# Altium schematic sheet ESC.SchDoc: MiniFly
size A4; Author: liujun6037; Revision: 0; Version: V1.32; SheetSize: A4
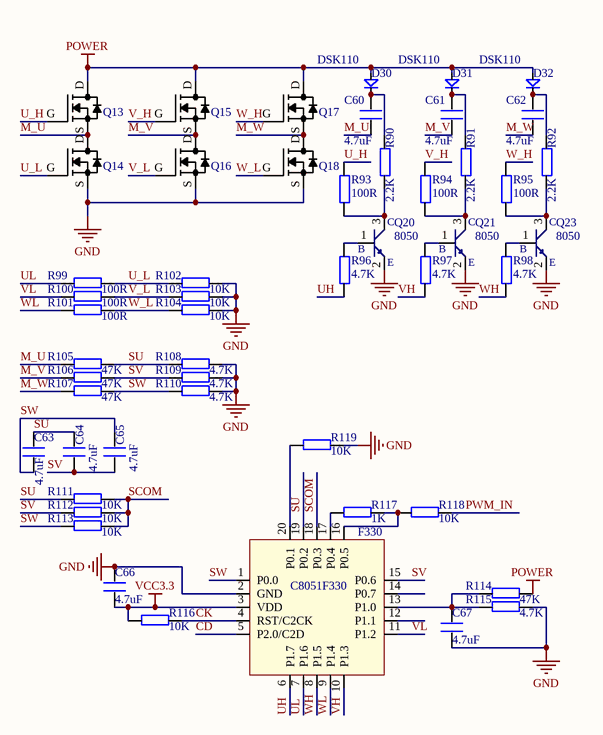
[diagram p0: ESC.SchDoc]

## Parts
C60  4.7uF  [C 0603_L]
C61  4.7uF  [C 0603_L]
C62  4.7uF  [C 0603_L]
C63  4.7uF  [C 0603_L]
C64  4.7uF  [C 0603_L]
C65  4.7uF  [C 0603_L]
C66  4.7uF  [C 0603_L]
C67  4.7uF  [C 0603_L]
D30  DSK110  [SOD-123F]
D31  DSK110  [SOD-123F]
D32  DSK110  [SOD-123F]
F330  C8051F330  [QFN20_4*4_L]
Q13  NTMFS5C628NLT  [SO_8FL_DFN5]  (value not drawn)
Q14  NTMFS5C628NLT  [SO_8FL_DFN5]  (value not drawn)
Q15  NTMFS5C628NLT  [SO_8FL_DFN5]  (value not drawn)
Q16  NTMFS5C628NLT  [SO_8FL_DFN5]  (value not drawn)
Q17  NTMFS5C628NLT  [SO_8FL_DFN5]  (value not drawn)
Q18  NTMFS5C628NLT  [SO_8FL_DFN5]  (value not drawn)
Q20  8050  [SOT23-3L]
Q21  8050  [SOT23-3L]
Q23  8050  [SOT23-3L]
R90  2.2K  [R 0603_L]
R91  2.2K  [R 0603_L]
R92  2.2K  [R 0603_L]
R93  100R  [R 0603_L]
R94  100R  [R 0603_L]
R95  100R  [R 0603_L]
R96  4.7K  [R 0603_L]
R97  4.7K  [R 0603_L]
R98  4.7K  [R 0603_L]
R99  100R  [R 0603_L]
R100  100R  [R 0603_L]
R101  100R  [R 0603_L]
R102  10K  [R 0603_L]
R103  10K  [R 0603_L]
R104  10K  [R 0603_L]
R105  47K  [R 0603_L]
R106  47K  [R 0603_L]
R107  47K  [R 0603_L]
R108  4.7K  [R 0603_L]
R109  4.7K  [R 0603_L]
R110  4.7K  [R 0603_L]
R111  10K  [R 0603_L]
R112  10K  [R 0603_L]
R113  10K  [R 0603_L]
R114  47K  [R 0603_L]
R115  4.7K  [R 0603_L]
R116  10K  [R 0603_L]
R117  1K  [R 0603_L]
R118  10K  [R 0603_L]
R119  10K  [R 0603_L]

## Nets
GND: C66.1 C67.2 F330.2(GND) Q14.S Q16.S Q18.S Q20.2(E) Q21.2(E) Q23.2(E) R102.1 R103.1 R104.1 R108.1 R109.1 R110.1 R115.1 R119.1
POWER: D30.1(A) D31.1(A) D32.1(A) Q13.D Q15.D Q17.D R114.1
VCC3.3: C66.2 F330.3(VDD) R116.2
CD: F330.5(P2.0/C2D)
CK: F330.4(RST/C2CK) R116.1
M_U: C60.1 Q13.S Q14.D R105.2
M_V: C61.1 Q15.S Q16.D R106.2
M_W: C62.1 Q17.S Q18.D R107.2
PWM_IN: R118.1
SCOM: F330.18(P0.3) R111.1 R112.1 R113.1
SU: C63.2 C64.2 F330.19(P0.2) R105.1 R108.2 R111.2
SV: C64.1 C65.1 F330.15(P0.6) R106.1 R109.2 R112.2
SW: C63.1 C65.2 F330.1(P0.0) R107.1 R110.2 R113.2
U_H: Q13.G R93.2
U_L: Q14.G R99.1 R102.2
UH: F330.6(P1.7) R96.1
UL: F330.7(P1.6) R99.2
V_H: Q15.G R94.2
V_L: Q16.G R100.1 R103.2
VH: F330.10(P1.3) R97.1
VL: F330.11(P1.2) R100.2
W_H: Q17.G R95.2
W_L: Q18.G R101.1 R104.2
WH: F330.8(P1.5) R98.1
WL: F330.9(P1.4) R101.2
NetC60_2: C60.2 D30.2(K) R90.2
NetC61_2: C61.2 D31.2(K) R91.2
NetC62_2: C62.2 D32.2(K) R92.2
NetC67_1: C67.1 F330.13(P1.0) R114.2 R115.2
NetF330_16: F330.16(P0.5) R117.1 R118.2
NetF330_17: F330.17(P0.4) R117.2
NetF330_20: F330.20(P0.1) R119.2
NetQ20_1: Q20.1(B) R96.2
NetQ20_3: Q20.3(C) R90.1 R93.1
NetQ21_1: Q21.1(B) R97.2
NetQ21_3: Q21.3(C) R91.1 R94.1
NetQ23_1: Q23.1(B) R98.2
NetQ23_3: Q23.3(C) R92.1 R95.1

Not connected (* = marked no-connect by the designer): F330 12(P1.1) 14(P0.7)

## Notes on the sheet
- Title:
- Author:
- Date:
- Revision:
- lycreturn@ALIENTEK
- Size:
- File:
- Version:

## Library data of the parts
C60-C67 = C
D30-D32 = DSK110: 通用二极管 100V-1A; BOM名称: 快恢复二极管; 版权归属: 源创客; 属性: 700V/1A
F330 = C8051F330: C8051F330单片机
Q13-Q18 = NTMFS5C628NLT: MOSFET N-CH 60V SO8FL; Manufacturer: ON Semiconductor; Manufacturer Part Number: NTMFS5C628NLT1G; FET Type: N-Channel; Drive Voltage (Max Rds On,  Min Rds On): 4.5V, 10V; Vgs(th) (Max) @ Id: 2V @ 135µA; Gate Charge (Qg) (Max) @ Vgs: 52nC @ 10V; Input Capacitance (Ciss) (Max) @ Vds: 3600pF @ 25V; Vgs (Max): ±20V; Power Dissipation (Max): 3.7W (Ta), 110W (Tc); Rds On (Max) @ Id, Vgs: 2.4 mOhm @ 50A, 10V; Supplier 1: Digi-Key; Supplier Part Number 1: NTMFS5C628NLT1GOSCT-ND; RoHS: RoHS Compliant; Category: Discrete Semiconductor Products; Stock: 1490; Pricing 1: 1=1.8, 10=1.627, 100=1.3078, 500=1.01716 (USD); Packaging: Cut Tape (CT); Part Status: Active; Technology: MOSFET (Metal Oxide); Current - Continuous Drain (Id) @ 25°C: -; FET Feature: -; Operating Temperature: -55°C ~ 175°C (TJ); Mounting Type: Surface Mount; Supplier Device Package: 5-DFN (5x6) (8-SOFL); Package / Case: 8-PowerTDFN; ComponentLink1URL: http://www.onsemi.com/pub/Collateral/NTMFS5C628NL-D.PDF; ComponentLink1Description: http://www.onsemi.com/pub/Collateral/NTMFS5C628NL-D.PDF; Supplier 2: Digi-Key; Supplier Part Number 2: NTMFS5C628NLT1GOSTR-ND; Pricing 2: 1500=0.81823 (USD)
Q20 Q21 Q23 = 8050NPN
R90-R119 = R